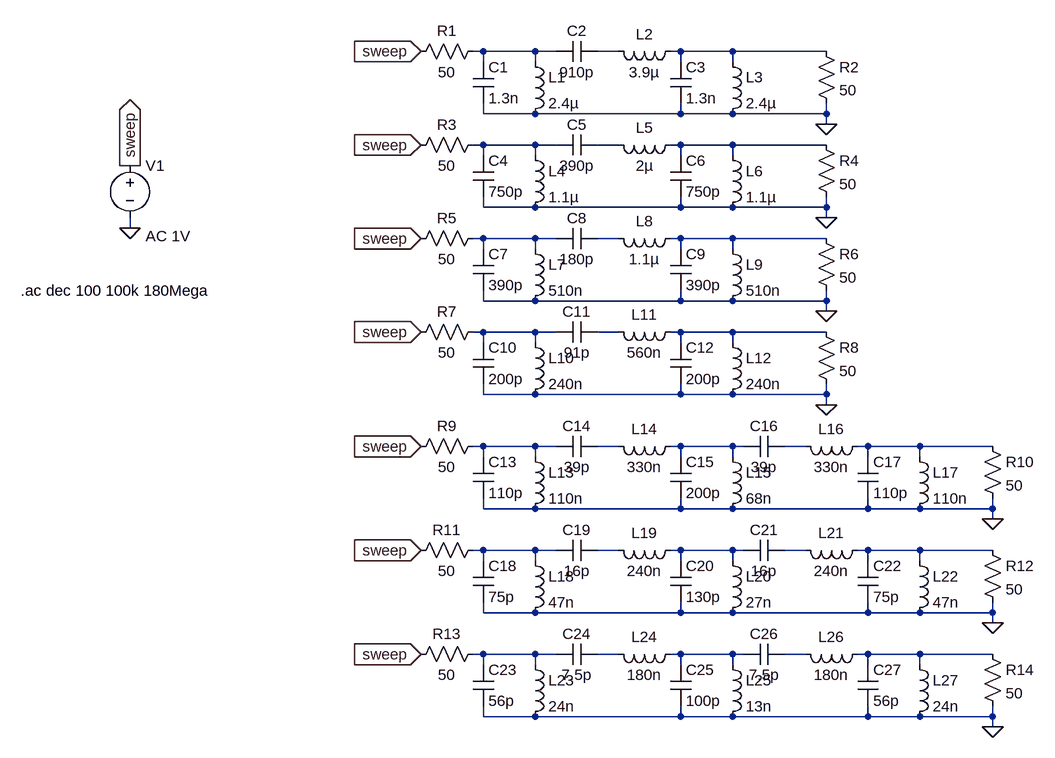
[diagram p0: schematic preselectorSimulations.asc]
preselectorSimulations.asc, the LTspice schematic file:
Version 4.1
SHEET 1 1140 1204
WIRE 288 144 272 144
WIRE 368 144 288 144
WIRE 400 144 368 144
WIRE 496 144 464 144
WIRE 592 144 576 144
WIRE 672 144 592 144
WIRE 816 144 672 144
WIRE 288 160 288 144
WIRE 368 160 368 144
WIRE 592 160 592 144
WIRE 672 160 672 144
WIRE 288 240 288 224
WIRE 368 240 288 240
WIRE 592 240 592 224
WIRE 592 240 368 240
WIRE 672 240 592 240
WIRE 816 240 816 224
WIRE 816 240 672 240
WIRE 816 256 816 240
WIRE 288 288 272 288
WIRE 368 288 288 288
WIRE 400 288 368 288
WIRE 496 288 464 288
WIRE 592 288 576 288
WIRE 672 288 592 288
WIRE 816 288 672 288
WIRE 288 304 288 288
WIRE 368 304 368 288
WIRE 592 304 592 288
WIRE 672 304 672 288
WIRE 288 384 288 368
WIRE 368 384 288 384
WIRE 592 384 592 368
WIRE 592 384 368 384
WIRE 672 384 592 384
WIRE 816 384 816 368
WIRE 816 384 672 384
WIRE 816 400 816 384
WIRE -256 416 -256 400
WIRE 288 432 272 432
WIRE 368 432 288 432
WIRE 400 432 368 432
WIRE 496 432 464 432
WIRE 592 432 576 432
WIRE 672 432 592 432
WIRE 816 432 672 432
WIRE 288 448 288 432
WIRE 368 448 368 432
WIRE 592 448 592 432
WIRE 672 448 672 432
WIRE 288 528 288 512
WIRE 368 528 288 528
WIRE 592 528 592 512
WIRE 592 528 368 528
WIRE 672 528 592 528
WIRE 816 528 816 512
WIRE 816 528 672 528
WIRE 816 544 816 528
WIRE 288 576 272 576
WIRE 368 576 288 576
WIRE 400 576 368 576
WIRE 496 576 464 576
WIRE 592 576 576 576
WIRE 672 576 592 576
WIRE 816 576 672 576
WIRE 288 592 288 576
WIRE 368 592 368 576
WIRE 592 592 592 576
WIRE 672 592 672 576
WIRE 288 672 288 656
WIRE 368 672 288 672
WIRE 592 672 592 656
WIRE 592 672 368 672
WIRE 672 672 592 672
WIRE 816 672 816 656
WIRE 816 672 672 672
WIRE 816 688 816 672
WIRE 288 752 272 752
WIRE 368 752 288 752
WIRE 400 752 368 752
WIRE 496 752 464 752
WIRE 592 752 576 752
WIRE 672 752 592 752
WIRE 688 752 672 752
WIRE 784 752 752 752
WIRE 880 752 864 752
WIRE 960 752 880 752
WIRE 1072 752 960 752
WIRE 288 768 288 752
WIRE 368 768 368 752
WIRE 592 768 592 752
WIRE 672 768 672 752
WIRE 880 768 880 752
WIRE 960 768 960 752
WIRE 288 848 288 832
WIRE 368 848 288 848
WIRE 592 848 592 832
WIRE 592 848 368 848
WIRE 672 848 592 848
WIRE 880 848 880 832
WIRE 880 848 672 848
WIRE 960 848 880 848
WIRE 1072 848 1072 832
WIRE 1072 848 960 848
WIRE 1072 864 1072 848
WIRE 288 912 272 912
WIRE 368 912 288 912
WIRE 400 912 368 912
WIRE 496 912 464 912
WIRE 592 912 576 912
WIRE 672 912 592 912
WIRE 688 912 672 912
WIRE 784 912 752 912
WIRE 880 912 864 912
WIRE 960 912 880 912
WIRE 1072 912 960 912
WIRE 288 928 288 912
WIRE 368 928 368 912
WIRE 592 928 592 912
WIRE 672 928 672 912
WIRE 880 928 880 912
WIRE 960 928 960 912
WIRE 288 1008 288 992
WIRE 368 1008 288 1008
WIRE 592 1008 592 992
WIRE 592 1008 368 1008
WIRE 672 1008 592 1008
WIRE 880 1008 880 992
WIRE 880 1008 672 1008
WIRE 960 1008 880 1008
WIRE 1072 1008 1072 992
WIRE 1072 1008 960 1008
WIRE 1072 1024 1072 1008
WIRE 288 1072 272 1072
WIRE 368 1072 288 1072
WIRE 400 1072 368 1072
WIRE 496 1072 464 1072
WIRE 592 1072 576 1072
WIRE 672 1072 592 1072
WIRE 688 1072 672 1072
WIRE 784 1072 752 1072
WIRE 880 1072 864 1072
WIRE 960 1072 880 1072
WIRE 1072 1072 960 1072
WIRE 288 1088 288 1072
WIRE 368 1088 368 1072
WIRE 592 1088 592 1072
WIRE 672 1088 672 1072
WIRE 880 1088 880 1072
WIRE 960 1088 960 1072
WIRE 288 1168 288 1152
WIRE 368 1168 288 1168
WIRE 592 1168 592 1152
WIRE 592 1168 368 1168
WIRE 672 1168 592 1168
WIRE 880 1168 880 1152
WIRE 880 1168 672 1168
WIRE 960 1168 880 1168
WIRE 1072 1168 1072 1152
WIRE 1072 1168 960 1168
WIRE 1072 1184 1072 1168
FLAG -256 416 0
FLAG 816 256 0
FLAG -256 320 sweep
IOPIN -256 320 Out
FLAG 192 144 sweep
IOPIN 192 144 In
FLAG 192 288 sweep
IOPIN 192 288 In
FLAG 816 400 0
FLAG 816 544 0
FLAG 192 432 sweep
IOPIN 192 432 In
FLAG 192 576 sweep
IOPIN 192 576 In
FLAG 816 688 0
FLAG 192 752 sweep
IOPIN 192 752 In
FLAG 1072 864 0
FLAG 192 912 sweep
IOPIN 192 912 In
FLAG 1072 1024 0
FLAG 192 1072 sweep
IOPIN 192 1072 In
FLAG 1072 1184 0
SYMBOL voltage -256 304 R0
WINDOW 123 24 124 Left 2
WINDOW 39 0 0 Left 0
SYMATTR Value2 AC 1V
SYMATTR InstName V1
SYMATTR Value ""
SYMBOL res 288 128 R90
WINDOW 0 0 56 VBottom 2
WINDOW 3 32 56 VTop 2
SYMATTR InstName R1
SYMATTR Value 50
SYMBOL cap 272 160 R0
SYMATTR InstName C1
SYMATTR Value 1.3n
SYMBOL ind 352 144 R0
SYMATTR InstName L1
SYMATTR Value 2.4µ
SYMATTR SpiceLine Rser=1m
SYMBOL cap 464 128 R90
WINDOW 0 0 32 VBottom 2
WINDOW 3 32 32 VTop 2
SYMATTR InstName C2
SYMATTR Value 910p
SYMBOL ind 592 128 R90
WINDOW 0 5 56 VBottom 2
WINDOW 3 32 56 VTop 2
SYMATTR InstName L2
SYMATTR Value 3.9µ
SYMATTR SpiceLine Rser=1m
SYMBOL cap 576 160 R0
SYMATTR InstName C3
SYMATTR Value 1.3n
SYMBOL ind 656 144 R0
SYMATTR InstName L3
SYMATTR Value 2.4µ
SYMATTR SpiceLine Rser=1m
SYMBOL res 800 128 R0
SYMATTR InstName R2
SYMATTR Value 50
SYMBOL res 288 272 R90
WINDOW 0 0 56 VBottom 2
WINDOW 3 32 56 VTop 2
SYMATTR InstName R3
SYMATTR Value 50
SYMBOL cap 272 304 R0
SYMATTR InstName C4
SYMATTR Value 750p
SYMBOL ind 352 288 R0
SYMATTR InstName L4
SYMATTR Value 1.1µ
SYMATTR SpiceLine Rser=1m
SYMBOL cap 464 272 R90
WINDOW 0 0 32 VBottom 2
WINDOW 3 32 32 VTop 2
SYMATTR InstName C5
SYMATTR Value 390p
SYMBOL ind 592 272 R90
WINDOW 0 5 56 VBottom 2
WINDOW 3 32 56 VTop 2
SYMATTR InstName L5
SYMATTR Value 2µ
SYMATTR SpiceLine Rser=1m
SYMBOL cap 576 304 R0
SYMATTR InstName C6
SYMATTR Value 750p
SYMBOL ind 656 288 R0
SYMATTR InstName L6
SYMATTR Value 1.1µ
SYMATTR SpiceLine Rser=1m
SYMBOL res 800 272 R0
SYMATTR InstName R4
SYMATTR Value 50
SYMBOL res 288 416 R90
WINDOW 0 0 56 VBottom 2
WINDOW 3 32 56 VTop 2
SYMATTR InstName R5
SYMATTR Value 50
SYMBOL cap 272 448 R0
SYMATTR InstName C7
SYMATTR Value 390p
SYMBOL ind 352 432 R0
SYMATTR InstName L7
SYMATTR Value 510n
SYMATTR SpiceLine Rser=1m
SYMBOL cap 464 416 R90
WINDOW 0 0 32 VBottom 2
WINDOW 3 32 32 VTop 2
SYMATTR InstName C8
SYMATTR Value 180p
SYMBOL ind 592 416 R90
WINDOW 0 5 56 VBottom 2
WINDOW 3 32 56 VTop 2
SYMATTR InstName L8
SYMATTR Value 1.1µ
SYMATTR SpiceLine Rser=1m
SYMBOL cap 576 448 R0
SYMATTR InstName C9
SYMATTR Value 390p
SYMBOL ind 656 432 R0
SYMATTR InstName L9
SYMATTR Value 510n
SYMATTR SpiceLine Rser=1m
SYMBOL res 800 416 R0
SYMATTR InstName R6
SYMATTR Value 50
SYMBOL res 288 560 R90
WINDOW 0 0 56 VBottom 2
WINDOW 3 32 56 VTop 2
SYMATTR InstName R7
SYMATTR Value 50
SYMBOL cap 272 592 R0
SYMATTR InstName C10
SYMATTR Value 200p
SYMBOL ind 352 576 R0
SYMATTR InstName L10
SYMATTR Value 240n
SYMATTR SpiceLine Rser=1m
SYMBOL cap 464 560 R90
WINDOW 0 0 32 VBottom 2
WINDOW 3 32 32 VTop 2
SYMATTR InstName C11
SYMATTR Value 91p
SYMBOL ind 592 560 R90
WINDOW 0 5 56 VBottom 2
WINDOW 3 32 56 VTop 2
SYMATTR InstName L11
SYMATTR Value 560n
SYMATTR SpiceLine Rser=1m
SYMBOL cap 576 592 R0
SYMATTR InstName C12
SYMATTR Value 200p
SYMBOL ind 656 576 R0
SYMATTR InstName L12
SYMATTR Value 240n
SYMATTR SpiceLine Rser=1m
SYMBOL res 800 560 R0
SYMATTR InstName R8
SYMATTR Value 50
SYMBOL res 288 736 R90
WINDOW 0 0 56 VBottom 2
WINDOW 3 32 56 VTop 2
SYMATTR InstName R9
SYMATTR Value 50
SYMBOL cap 272 768 R0
SYMATTR InstName C13
SYMATTR Value 110p
SYMBOL ind 352 752 R0
SYMATTR InstName L13
SYMATTR Value 110n
SYMATTR SpiceLine Rser=1m
SYMBOL cap 464 736 R90
WINDOW 0 0 32 VBottom 2
WINDOW 3 32 32 VTop 2
SYMATTR InstName C14
SYMATTR Value 39p
SYMBOL ind 592 736 R90
WINDOW 0 5 56 VBottom 2
WINDOW 3 32 56 VTop 2
SYMATTR InstName L14
SYMATTR Value 330n
SYMATTR SpiceLine Rser=1m
SYMBOL cap 576 768 R0
SYMATTR InstName C15
SYMATTR Value 200p
SYMBOL ind 656 752 R0
SYMATTR InstName L15
SYMATTR Value 68n
SYMATTR SpiceLine Rser=1m
SYMBOL cap 752 736 R90
WINDOW 0 0 32 VBottom 2
WINDOW 3 32 32 VTop 2
SYMATTR InstName C16
SYMATTR Value 39p
SYMBOL ind 880 736 R90
WINDOW 0 5 56 VBottom 2
WINDOW 3 32 56 VTop 2
SYMATTR InstName L16
SYMATTR Value 330n
SYMATTR SpiceLine Rser=1m
SYMBOL cap 864 768 R0
SYMATTR InstName C17
SYMATTR Value 110p
SYMBOL ind 944 752 R0
SYMATTR InstName L17
SYMATTR Value 110n
SYMATTR SpiceLine Rser=1m
SYMBOL res 1056 736 R0
SYMATTR InstName R10
SYMATTR Value 50
SYMBOL res 288 896 R90
WINDOW 0 0 56 VBottom 2
WINDOW 3 32 56 VTop 2
SYMATTR InstName R11
SYMATTR Value 50
SYMBOL cap 272 928 R0
SYMATTR InstName C18
SYMATTR Value 75p
SYMBOL ind 352 912 R0
SYMATTR InstName L18
SYMATTR Value 47n
SYMATTR SpiceLine Rser=1m
SYMBOL cap 464 896 R90
WINDOW 0 0 32 VBottom 2
WINDOW 3 32 32 VTop 2
SYMATTR InstName C19
SYMATTR Value 16p
SYMBOL ind 592 896 R90
WINDOW 0 5 56 VBottom 2
WINDOW 3 32 56 VTop 2
SYMATTR InstName L19
SYMATTR Value 240n
SYMATTR SpiceLine Rser=1m
SYMBOL cap 576 928 R0
SYMATTR InstName C20
SYMATTR Value 130p
SYMBOL ind 656 912 R0
SYMATTR InstName L20
SYMATTR Value 27n
SYMATTR SpiceLine Rser=1m
SYMBOL cap 752 896 R90
WINDOW 0 0 32 VBottom 2
WINDOW 3 32 32 VTop 2
SYMATTR InstName C21
SYMATTR Value 16p
SYMBOL ind 880 896 R90
WINDOW 0 5 56 VBottom 2
WINDOW 3 32 56 VTop 2
SYMATTR InstName L21
SYMATTR Value 240n
SYMATTR SpiceLine Rser=1m
SYMBOL cap 864 928 R0
SYMATTR InstName C22
SYMATTR Value 75p
SYMBOL ind 944 912 R0
SYMATTR InstName L22
SYMATTR Value 47n
SYMATTR SpiceLine Rser=1m
SYMBOL res 1056 896 R0
SYMATTR InstName R12
SYMATTR Value 50
SYMBOL res 288 1056 R90
WINDOW 0 0 56 VBottom 2
WINDOW 3 32 56 VTop 2
SYMATTR InstName R13
SYMATTR Value 50
SYMBOL cap 272 1088 R0
SYMATTR InstName C23
SYMATTR Value 56p
SYMBOL ind 352 1072 R0
SYMATTR InstName L23
SYMATTR Value 24n
SYMATTR SpiceLine Rser=1m
SYMBOL cap 464 1056 R90
WINDOW 0 0 32 VBottom 2
WINDOW 3 32 32 VTop 2
SYMATTR InstName C24
SYMATTR Value 7.5p
SYMBOL ind 592 1056 R90
WINDOW 0 5 56 VBottom 2
WINDOW 3 32 56 VTop 2
SYMATTR InstName L24
SYMATTR Value 180n
SYMATTR SpiceLine Rser=1m
SYMBOL cap 576 1088 R0
SYMATTR InstName C25
SYMATTR Value 100p
SYMBOL ind 656 1072 R0
SYMATTR InstName L25
SYMATTR Value 13n
SYMATTR SpiceLine Rser=1m
SYMBOL cap 752 1056 R90
WINDOW 0 0 32 VBottom 2
WINDOW 3 32 32 VTop 2
SYMATTR InstName C26
SYMATTR Value 7.5p
SYMBOL ind 880 1056 R90
WINDOW 0 5 56 VBottom 2
WINDOW 3 32 56 VTop 2
SYMATTR InstName L26
SYMATTR Value 180n
SYMATTR SpiceLine Rser=1m
SYMBOL cap 864 1088 R0
SYMATTR InstName C27
SYMATTR Value 56p
SYMBOL ind 944 1072 R0
SYMATTR InstName L27
SYMATTR Value 24n
SYMATTR SpiceLine Rser=1m
SYMBOL res 1056 1056 R0
SYMATTR InstName R14
SYMATTR Value 50
TEXT -424 512 Left 2 !.ac dec 100 100k 180Mega

The netlist it stands for:
* preselectorSimulations.asc
V1 sweep 0 AC 1V
R1 N001 sweep 50
C1 N001 0 1.3n
L1 N001 0 2.4µ Rser=1m
C2 N002 N001 910p
L2 N003 N002 3.9µ Rser=1m
C3 N003 0 1.3n
L3 N003 0 2.4µ Rser=1m
R2 N003 0 50
R3 N004 sweep 50
C4 N004 0 750p
L4 N004 0 1.1µ Rser=1m
C5 N005 N004 390p
L5 N006 N005 2µ Rser=1m
C6 N006 0 750p
L6 N006 0 1.1µ Rser=1m
R4 N006 0 50
R5 N007 sweep 50
C7 N007 0 390p
L7 N007 0 510n Rser=1m
C8 N008 N007 180p
L8 N009 N008 1.1µ Rser=1m
C9 N009 0 390p
L9 N009 0 510n Rser=1m
R6 N009 0 50
R7 N010 sweep 50
C10 N010 0 200p
L10 N010 0 240n Rser=1m
C11 N011 N010 91p
L11 N012 N011 560n Rser=1m
C12 N012 0 200p
L12 N012 0 240n Rser=1m
R8 N012 0 50
R9 N013 sweep 50
C13 N013 0 110p
L13 N013 0 110n Rser=1m
C14 N014 N013 39p
L14 N015 N014 330n Rser=1m
C15 N015 0 200p
L15 N015 0 68n Rser=1m
C16 N016 N015 39p
L16 N017 N016 330n Rser=1m
C17 N017 0 110p
L17 N017 0 110n Rser=1m
R10 N017 0 50
R11 N018 sweep 50
C18 N018 0 75p
L18 N018 0 47n Rser=1m
C19 N019 N018 16p
L19 N020 N019 240n Rser=1m
C20 N020 0 130p
L20 N020 0 27n Rser=1m
C21 N021 N020 16p
L21 N022 N021 240n Rser=1m
C22 N022 0 75p
L22 N022 0 47n Rser=1m
R12 N022 0 50
R13 N023 sweep 50
C23 N023 0 56p
L23 N023 0 24n Rser=1m
C24 N024 N023 7.5p
L24 N025 N024 180n Rser=1m
C25 N025 0 100p
L25 N025 0 13n Rser=1m
C26 N026 N025 7.5p
L26 N027 N026 180n Rser=1m
C27 N027 0 56p
L27 N027 0 24n Rser=1m
R14 N027 0 50
.ac dec 100 100k 180Mega
.backanno
.end